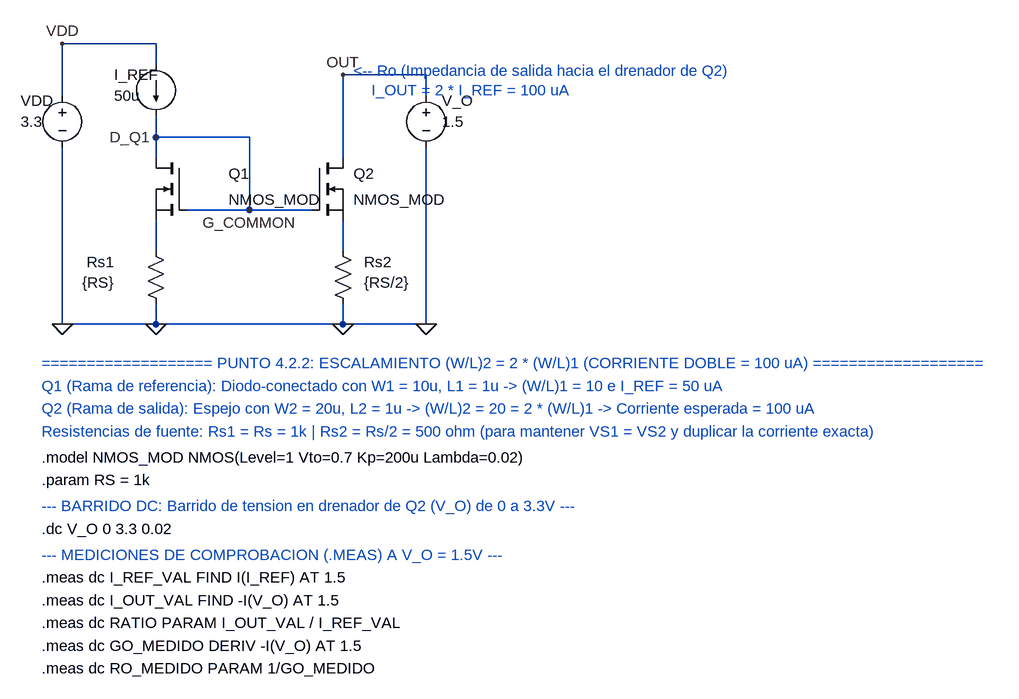
[diagram p0: schematic 4_2_2_Espejo_Corriente_MOS.asc]
4_2_2_Espejo_Corriente_MOS.asc, the LTspice schematic file:
Version 4
SHEET 1 1200 900
WIRE 112 48 256 48
WIRE 112 48 112 128
WIRE 112 208 112 240
WIRE 256 48 256 80
WIRE 256 160 256 192
WIRE 256 192 256 224
WIRE 256 192 400 192
WIRE 400 192 400 304
WIRE 304 304 400 304
WIRE 400 304 496 304
WIRE 256 320 256 368
WIRE 256 448 256 480
WIRE 544 96 544 224
WIRE 544 96 672 96
WIRE 672 96 672 128
WIRE 672 208 672 240
WIRE 544 320 544 368
WIRE 544 448 544 480
WIRE 112 480 672 480
WIRE 672 240 672 480
WIRE 112 240 112 480
FLAG 112 480 0
FLAG 256 480 0
FLAG 544 480 0
FLAG 672 480 0
FLAG 112 48 VDD
FLAG 544 96 OUT
FLAG 256 192 D_Q1
FLAG 400 304 G_COMMON
SYMBOL voltage 112 112 R0
WINDOW 0 -64 24 Left 2
WINDOW 3 -64 56 Left 2
SYMATTR InstName VDD
SYMATTR Value 3.3
SYMBOL current 256 80 R0
WINDOW 0 -64 16 Left 2
WINDOW 3 -64 48 Left 2
SYMATTR InstName I_REF
SYMATTR Value 50u
SYMBOL nmos 304 224 M0
WINDOW 0 -64 24 Right 2
WINDOW 3 -64 64 Right 2
SYMATTR InstName Q1
SYMATTR Value NMOS_MOD
SYMATTR Value2 W=10u L=1u
SYMBOL nmos 496 224 R0
WINDOW 0 64 24 Left 2
WINDOW 3 64 64 Left 2
SYMATTR InstName Q2
SYMATTR Value NMOS_MOD
SYMATTR Value2 W=20u L=1u
SYMBOL res 240 352 R0
WINDOW 0 -48 32 Right 2
WINDOW 3 -48 64 Right 2
SYMATTR InstName Rs1
SYMATTR Value {RS}
SYMBOL res 528 352 R0
WINDOW 0 48 32 Left 2
WINDOW 3 48 64 Left 2
SYMATTR InstName Rs2
SYMATTR Value {RS/2}
SYMBOL voltage 672 112 R0
WINDOW 0 24 24 Left 2
WINDOW 3 24 56 Left 2
SYMATTR InstName V_O
SYMATTR Value 1.5
TEXT 80 540 Left 2 ;=================== PUNTO 4.2.2: ESCALAMIENTO (W/L)2 = 2 * (W/L)1 (CORRIENTE DOBLE = 100 uA) ===================
TEXT 80 575 Left 2 ;Q1 (Rama de referencia): Diodo-conectado con W1 = 10u, L1 = 1u -> (W/L)1 = 10 e I_REF = 50 uA
TEXT 80 610 Left 2 ;Q2 (Rama de salida): Espejo con W2 = 20u, L2 = 1u -> (W/L)2 = 20 = 2 * (W/L)1 -> Corriente esperada = 100 uA
TEXT 80 645 Left 2 ;Resistencias de fuente: Rs1 = Rs = 1k | Rs2 = Rs/2 = 500 ohm (para mantener VS1 = VS2 y duplicar la corriente exacta)
TEXT 80 685 Left 2 !.model NMOS_MOD NMOS(Level=1 Vto=0.7 Kp=200u Lambda=0.02)
TEXT 80 720 Left 2 !.param RS = 1k
TEXT 80 760 Left 2 ;--- BARRIDO DC: Barrido de tension en drenador de Q2 (V_O) de 0 a 3.3V ---
TEXT 80 795 Left 2 !.dc V_O 0 3.3 0.02
TEXT 80 835 Left 2 ;--- MEDICIONES DE COMPROBACION (.MEAS) A V_O = 1.5V ---
TEXT 80 870 Left 2 !.meas dc I_REF_VAL FIND I(I_REF) AT 1.5
TEXT 80 905 Left 2 !.meas dc I_OUT_VAL FIND -I(V_O) AT 1.5
TEXT 80 940 Left 2 !.meas dc RATIO PARAM I_OUT_VAL / I_REF_VAL
TEXT 80 975 Left 2 !.meas dc GO_MEDIDO DERIV -I(V_O) AT 1.5
TEXT 80 1010 Left 2 !.meas dc RO_MEDIDO PARAM 1/GO_MEDIDO
TEXT 560 90 Left 2 ;<-- Ro (Impedancia de salida hacia el drenador de Q2)
TEXT 560 120 Left 2 ;    I_OUT = 2 * I_REF = 100 uA

The netlist it stands for:
* 4_2_2_Espejo_Corriente_MOS.asc
VDD VDD 0 3.3
I_REF VDD G_COMMON 50u
M§Q1 G_COMMON G_COMMON N001 N001 NMOS_MOD W=10u L=1u
M§Q2 OUT G_COMMON N002 N002 NMOS_MOD W=20u L=1u
Rs1 N001 0 {RS}
Rs2 N002 0 {RS/2}
V_O OUT 0 1.5
.model NMOS NMOS
.model PMOS PMOS
.lib standard.mos
* =================== PUNTO 4.2.2: ESCALAMIENTO (W/L)2 = 2 * (W/L)1 (CORRIENTE DOBLE = 100 uA) ===================
* Q1 (Rama de referencia): Diodo-conectado con W1 = 10u, L1 = 1u -> (W/L)1 = 10 e I_REF = 50 uA
* Q2 (Rama de salida): Espejo con W2 = 20u, L2 = 1u -> (W/L)2 = 20 = 2 * (W/L)1 -> Corriente esperada = 100 uA
* Resistencias de fuente: Rs1 = Rs = 1k | Rs2 = Rs/2 = 500 ohm (para mantener VS1 = VS2 y duplicar la corriente exacta)
.model NMOS_MOD NMOS(Level=1 Vto=0.7 Kp=200u Lambda=0.02)
.param RS = 1k
* --- BARRIDO DC: Barrido de tension en drenador de Q2 (V_O) de 0 a 3.3V ---
.dc V_O 0 3.3 0.02
* --- MEDICIONES DE COMPROBACION (.MEAS) A V_O = 1.5V ---
.meas dc I_REF_VAL FIND I(I_REF) AT 1.5
.meas dc I_OUT_VAL FIND -I(V_O) AT 1.5
.meas dc RATIO PARAM I_OUT_VAL / I_REF_VAL
.meas dc GO_MEDIDO DERIV -I(V_O) AT 1.5
.meas dc RO_MEDIDO PARAM 1/GO_MEDIDO
* <-- Ro (Impedancia de salida hacia el drenador de Q2)
*     I_OUT = 2 * I_REF = 100 uA
.backanno
.end